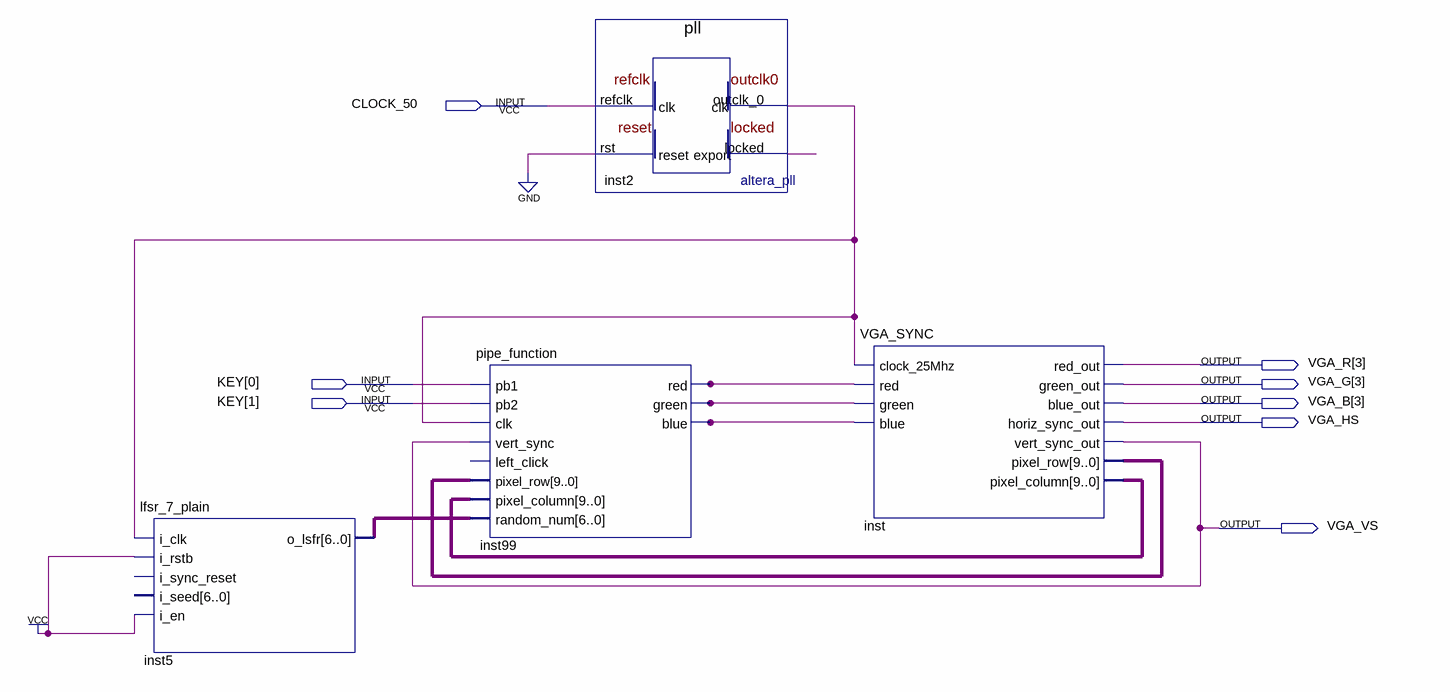
[diagram p0: schematic sheet]
// Quartus schematic backgroundcolourchangeexample.bdf as structural Verilog: 4 symbols, 8 pins
module backgroundcolourchangeexample (
  input  CLOCK_50,
  input  [1:0] KEY,
  output [3:3] VGA_R,
  output [3:3] VGA_G,
  output [3:3] VGA_B,
  output VGA_HS,
  output VGA_VS
);

  wire inst2_locked, inst2_outclk_0, inst99_blue, inst99_green, inst99_red;
  wire [6:0] inst5_o_lsfr;
  wire [9:0] inst_pixel_column, inst_pixel_row;

  lfsr_7_plain inst5 (
    .i_clk(inst2_outclk_0), .i_rstb(1'b1), .i_en(1'b1), .o_lsfr(inst5_o_lsfr));  // open: i_sync_reset, i_seed
  pipe_function inst99 (
    .pb1(KEY[0]), .pb2(KEY[1]), .clk(inst2_outclk_0), .vert_sync(VGA_VS), .pixel_row(inst_pixel_row),
    .pixel_column(inst_pixel_column), .random_num(inst5_o_lsfr), .red(inst99_red), .green(inst99_green),
    .blue(inst99_blue));  // open: left_click
  pll inst2 (.refclk(CLOCK_50), .rst(1'b0), .outclk_0(inst2_outclk_0), .locked(inst2_locked));
  VGA_SYNC inst (
    .clock_25Mhz(inst2_outclk_0), .red(inst99_red), .green(inst99_green), .blue(inst99_blue),
    .red_out(VGA_R[3]), .green_out(VGA_G[3]), .blue_out(VGA_B[3]), .horiz_sync_out(VGA_HS),
    .vert_sync_out(VGA_VS), .pixel_row(inst_pixel_row), .pixel_column(inst_pixel_column));
endmodule
